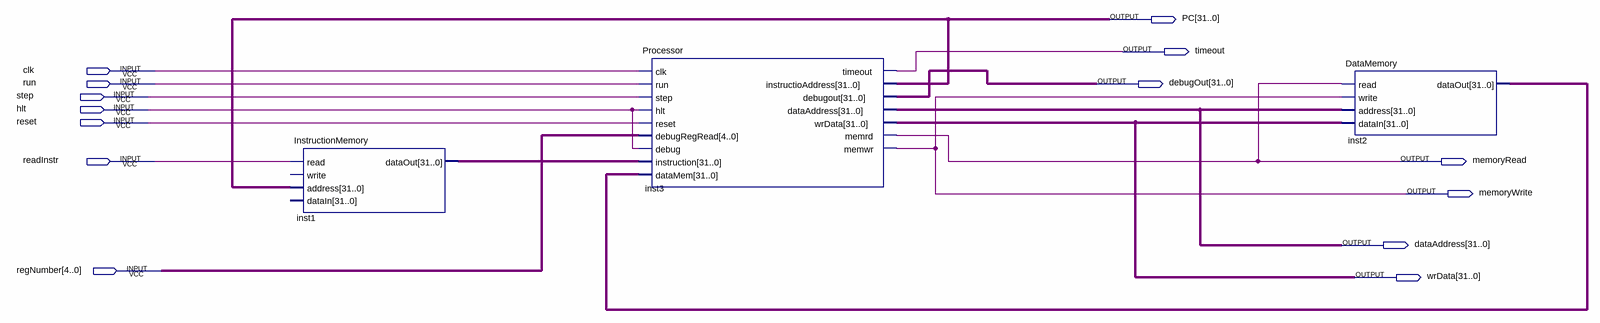
[diagram p0: schematic sheet]
// Quartus schematic ProcessorBlock.bdf as structural Verilog: 3 symbols, 14 pins
module ProcessorBlock (
  input  clk,
  input  run,
  input  step,
  input  hlt,
  input  reset,
  input  readInstr,
  input  [4:0] regNumber,
  output [31:0] PC,
  output timeout,
  output [31:0] debugOut,
  output memoryRead,
  output memoryWrite,
  output [31:0] dataAddress,
  output [31:0] wrData
);

  wire [31:0] inst1_dataout, inst2_dataout;

  InstructionMemory inst1 (.read(readInstr), .address(PC), .dataOut(inst1_dataout));  // open: write, dataIn
  Processor inst3 (
    .clk(clk), .run(run), .step(step), .hlt(hlt), .reset(reset), .debugRegRead(regNumber), .debug(hlt),
    .instruction(inst1_dataout), .dataMem(inst2_dataout), .timeout(timeout), .instructioAddress(PC),
    .debugout(debugOut), .dataAddress(dataAddress), .wrData(wrData), .memrd(memoryRead), .memwr(memoryWrite));
  DataMemory inst2 (
    .read(memoryRead), .write(memoryWrite), .address(dataAddress), .dataIn(wrData), .dataOut(inst2_dataout));
endmodule
